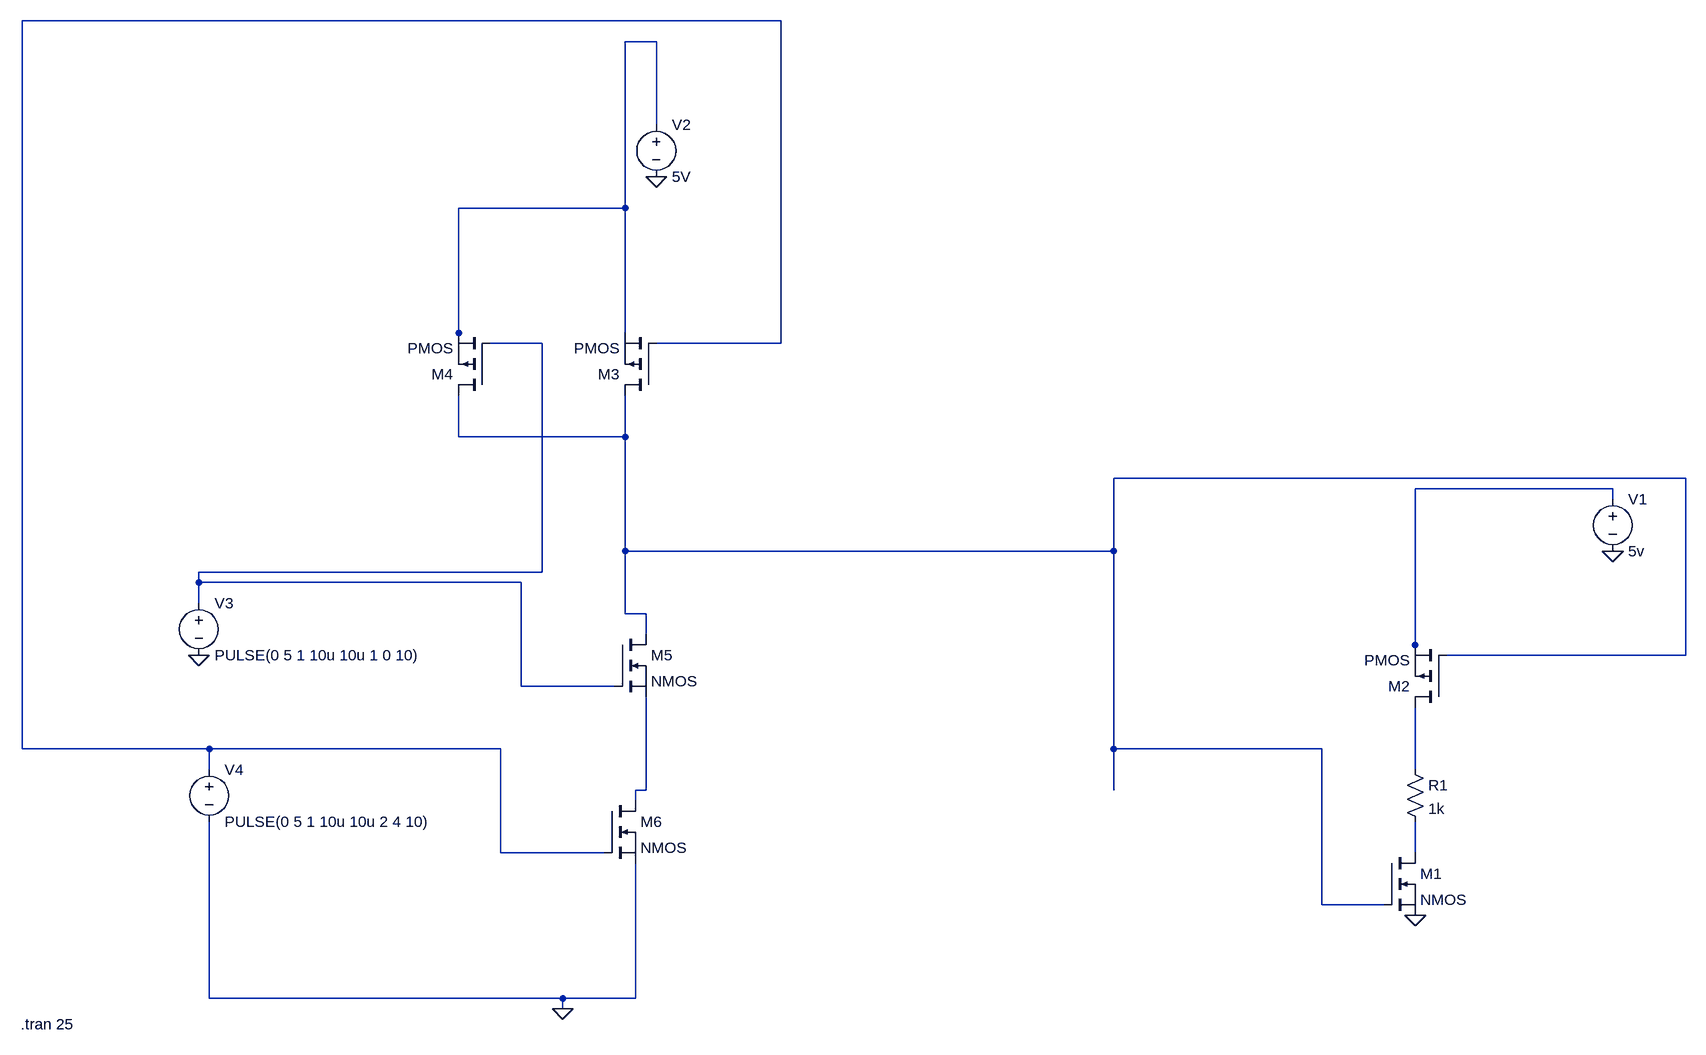
[diagram p0: schematic Cmos_AND.asc]
Cmos_AND.asc, the LTspice schematic file:
Version 4
SHEET 1 880 696
WIRE -736 -864 -1904 -864
WIRE -928 -832 -976 -832
WIRE -928 -704 -928 -832
WIRE -976 -576 -976 -832
WIRE -976 -576 -1232 -576
WIRE -1232 -384 -1232 -576
WIRE -976 -384 -976 -576
WIRE -1232 -368 -1232 -384
WIRE -1104 -368 -1184 -368
WIRE -736 -368 -736 -864
WIRE -736 -368 -928 -368
WIRE -1232 -224 -1232 -288
WIRE -976 -224 -976 -288
WIRE -976 -224 -1232 -224
WIRE 656 -160 -224 -160
WIRE 544 -144 240 -144
WIRE 544 -128 544 -144
WIRE -976 -48 -976 -224
WIRE -224 -48 -224 -160
WIRE -224 -48 -976 -48
WIRE -1104 -16 -1104 -368
WIRE -1104 -16 -1632 -16
WIRE -1632 0 -1632 -16
WIRE -1136 0 -1632 0
WIRE -1632 32 -1632 0
WIRE -976 48 -976 -48
WIRE -944 48 -976 48
WIRE -944 80 -944 48
WIRE 240 96 240 -144
WIRE 240 112 240 96
WIRE 656 112 656 -160
WIRE 656 112 288 112
WIRE -1136 160 -1136 0
WIRE -992 160 -1136 160
WIRE -1904 256 -1904 -864
WIRE -1616 256 -1904 256
WIRE -1168 256 -1616 256
WIRE -224 256 -224 -48
WIRE 96 256 -224 256
WIRE -1616 288 -1616 256
WIRE 240 288 240 192
WIRE -944 320 -944 176
WIRE -944 320 -960 320
WIRE -224 320 -224 256
WIRE -960 336 -960 320
WIRE -1168 416 -1168 256
WIRE -1008 416 -1168 416
WIRE 240 416 240 368
WIRE 96 496 96 256
WIRE 192 496 96 496
WIRE -1616 640 -1616 368
WIRE -1072 640 -1616 640
WIRE -960 640 -960 432
WIRE -960 640 -1072 640
WIRE -1072 656 -1072 640
FLAG 544 -48 0
FLAG 240 512 0
FLAG -1072 656 0
FLAG -928 -624 0
FLAG -1632 112 0
SYMBOL nmos 192 416 R0
SYMATTR InstName M1
SYMBOL voltage 544 -144 R0
WINDOW 123 0 0 Left 0
WINDOW 39 0 0 Left 0
SYMATTR InstName V1
SYMATTR Value 5v
SYMBOL res 224 272 R0
SYMATTR InstName R1
SYMATTR Value 1k
SYMBOL pmos 288 192 R180
SYMATTR InstName M2
SYMBOL pmos -928 -288 R180
SYMATTR InstName M3
SYMBOL pmos -1184 -288 R180
SYMATTR InstName M4
SYMBOL voltage -928 -720 R0
WINDOW 123 0 0 Left 0
WINDOW 39 0 0 Left 0
SYMATTR InstName V2
SYMATTR Value 5V
SYMBOL voltage -1632 16 R0
WINDOW 123 0 0 Left 0
WINDOW 39 0 0 Left 0
SYMATTR InstName V3
SYMATTR Value PULSE(0 5 1 10u 10u 1 0 10)
SYMBOL voltage -1616 272 R0
WINDOW 123 0 0 Left 0
WINDOW 39 0 0 Left 0
SYMATTR InstName V4
SYMATTR Value PULSE(0 5 1 10u 10u 2 4 10)
SYMBOL nmos -992 80 R0
SYMATTR InstName M5
SYMBOL nmos -1008 336 R0
SYMATTR InstName M6
TEXT -1906 680 Left 2 !.tran 25

The netlist it stands for:
* Cmos_AND.asc
M1 N008 N004 0 0 NMOS
V1 N005 0 5v
R1 N006 N008 1k
M2 N006 N004 N005 N005 PMOS
M3 N004 N001 N002 N002 PMOS
M4 N004 N003 N002 N002 PMOS
V2 N002 0 5V
V3 N003 0 PULSE(0 5 1 10u 10u 1 0 10)
V4 N001 0 PULSE(0 5 1 10u 10u 2 4 10)
M5 N004 N003 N007 N007 NMOS
M6 N007 N001 0 0 NMOS
.model NMOS NMOS
.model PMOS PMOS
.lib standard.mos
.tran 25
.backanno
.end